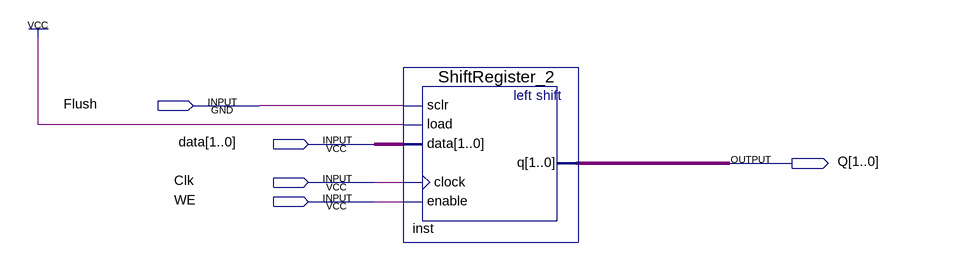
[diagram p0: schematic sheet]
// Quartus schematic ShiftRegister2.bdf as structural Verilog: 1 symbols, 5 pins
module ShiftRegister2 (
  input  Flush,
  input  [1:0] data,
  input  Clk,
  input  WE,
  output [1:0] Q
);

  ShiftRegister_2 inst (.sclr(Flush), .load(1'b1), .data(data), .clock(Clk), .enable(WE), .q(Q));
endmodule
